# Altium schematic sheet Quantizer.SchDoc
size A4
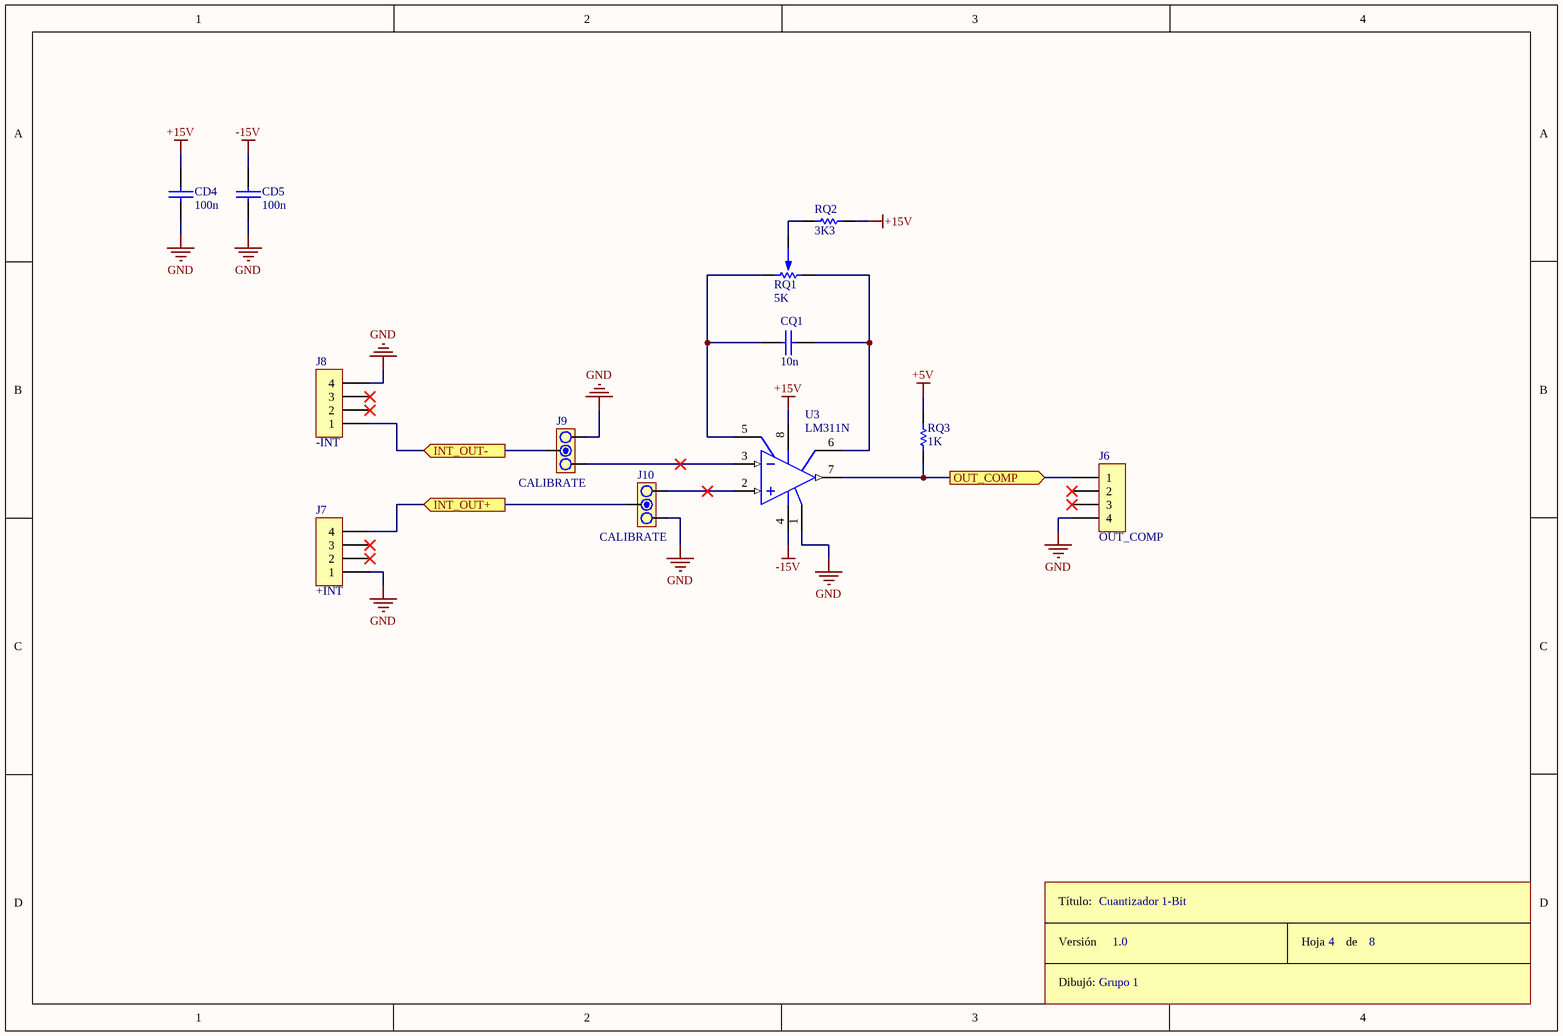
[diagram p0: Quantizer.SchDoc]

## Parts
CD4  100n  [CAP100]
CD5  100n  [CAP100]
CQ1  10n  [CAP100]
J6  OUT_COMP  [SIP4]
J7  +INT  [SIP4]
J8  -INT  [SIP4]
J9  CALIBRATE  [JUMPER3]
J10  CALIBRATE  [JUMPER3]
ROT3  Rótulo  (value not drawn)
RQ1  5K  [PRESET V]
RQ2  3K3  [RES300]
RQ3  1K  [RES300]
U3  LM311N  [626-05]

## Ports
INT_OUT+ (in), INT_OUT- (in), OUT_COMP (out)

## Nets
+5V: RQ3.2
+15V: CD4.1 RQ2.2 U3.8(V+)
-15V: CD5.1 U3.4(V-)
GND: CD4.2 CD5.2 J6.4 J7.1 J8.4 J9.1 J10.3 U3.1(GND)
INT_OUT+: J7.4 J10.2 ; port INT_OUT+
INT_OUT-: J8.1 J9.2 ; port INT_OUT-
OUT_COMP: J6.1 RQ3.1 U3.7(OUT) ; port OUT_COMP
NetCQ1_1: CQ1.1 RQ1.1 U3.5(BAL)
NetCQ1_2: CQ1.2 RQ1.3 U3.6(BAL/STB)
NetJ9_3: J9.3 U3.3(IN-)
NetJ10_1: J10.1 U3.2(IN+)
NetRQ1_2: RQ1.2 RQ2.1

Not connected (* = marked no-connect by the designer): J6 2* 3*; J7 2* 3*; J8 2* 3*

## Notes on the sheet
- Cuantizador 1-Bit
- Grupo 1
- 1.0
- 4
- 8
- (in symbol Rótulo) Título:; Versión; Hoja       de; Dibujó:

## Library data of the parts
CD4 CD5 CQ1 = CAP
J6-J8 = CON4
J9 J10 = JUMPER3
RQ1 = PRESET
RQ2 RQ3 = RES
U3 = LM311N: High-Performance Voltage Comparator; Published: 17-Jul-2002; LatestRevisionDate: 06-Jun-2005; LatestRevisionNote: Stylized 3D Model Added.; DatasheetVersion: 1988; PackageReference: 626-05; Publisher: Altium Limited; PackageDescription: DIP; 8 Leads; Row Spacing 7.62 mm; Pitch 2.54 mm; ComponentLink1Description: Manufacturer Link; ComponentLink1URL: http://www.onsemi.com/site/products/taxonomy/0,4438,133,00.html